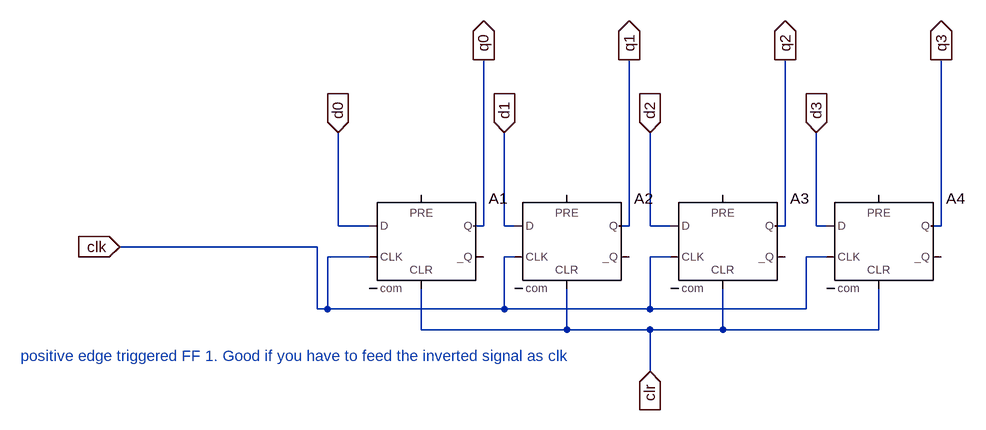
[diagram p0: schematic 1st_stage_pos_edge_4bit_pipo.asc]
1st_stage_pos_edge_4bit_pipo.asc, the LTspice schematic file:
Version 4
SHEET 1 1096 680
WIRE 96 208 96 64
WIRE 144 208 96 208
WIRE 320 208 320 -48
WIRE 320 208 304 208
WIRE 352 208 352 64
WIRE 368 208 352 208
WIRE 544 208 544 -48
WIRE 544 208 528 208
WIRE 576 208 576 64
WIRE 608 208 576 208
WIRE 784 208 784 -48
WIRE 784 208 768 208
WIRE 832 208 832 64
WIRE 848 208 832 208
WIRE 1024 208 1024 -48
WIRE 1024 208 1008 208
WIRE 64 240 -240 240
WIRE 144 256 80 256
WIRE 368 256 352 256
WIRE 608 256 576 256
WIRE 848 256 816 256
WIRE 64 336 64 240
WIRE 80 336 80 256
WIRE 80 336 64 336
WIRE 352 336 352 256
WIRE 352 336 80 336
WIRE 576 336 576 256
WIRE 576 336 352 336
WIRE 816 336 816 256
WIRE 816 336 576 336
WIRE 224 368 224 304
WIRE 448 368 448 304
WIRE 448 368 224 368
WIRE 576 368 448 368
WIRE 688 368 688 304
WIRE 688 368 576 368
WIRE 928 368 928 304
WIRE 928 368 688 368
WIRE 576 432 576 368
FLAG 96 64 d0
IOPIN 96 64 In
FLAG 352 64 d1
IOPIN 352 64 In
FLAG 576 64 d2
IOPIN 576 64 In
FLAG 832 64 d3
IOPIN 832 64 In
FLAG 320 -48 q0
IOPIN 320 -48 Out
FLAG 544 -48 q1
IOPIN 544 -48 Out
FLAG 784 -48 q2
IOPIN 784 -48 Out
FLAG 1024 -48 q3
IOPIN 1024 -48 Out
FLAG -240 240 clk
IOPIN -240 240 In
FLAG 576 432 clr
IOPIN 576 432 In
SYMBOL Digital\\dflop 224 160 R0
SYMATTR InstName A1
SYMBOL Digital\\dflop 448 160 R0
SYMATTR InstName A2
SYMBOL Digital\\dflop 688 160 R0
SYMATTR InstName A3
SYMBOL Digital\\dflop 928 160 R0
SYMATTR InstName A4
TEXT -392 408 Left 2 ;positive edge triggered FF 1. Good if you have to feed the inverted signal as clk

The netlist it stands for:
* 1st_stage_pos_edge_4bit_pipo.asc
A1 d0 0 clk 0 clr 0 q0 0 DFLOP
A2 d1 0 clk 0 clr 0 q1 0 DFLOP
A3 d2 0 clk 0 clr 0 q2 0 DFLOP
A4 d3 0 clk 0 clr 0 q3 0 DFLOP
* positive edge triggered FF 1. Good if you have to feed the inverted signal as clk
.backanno
.end